# Altium project WIoT-QC01.PrjPcb
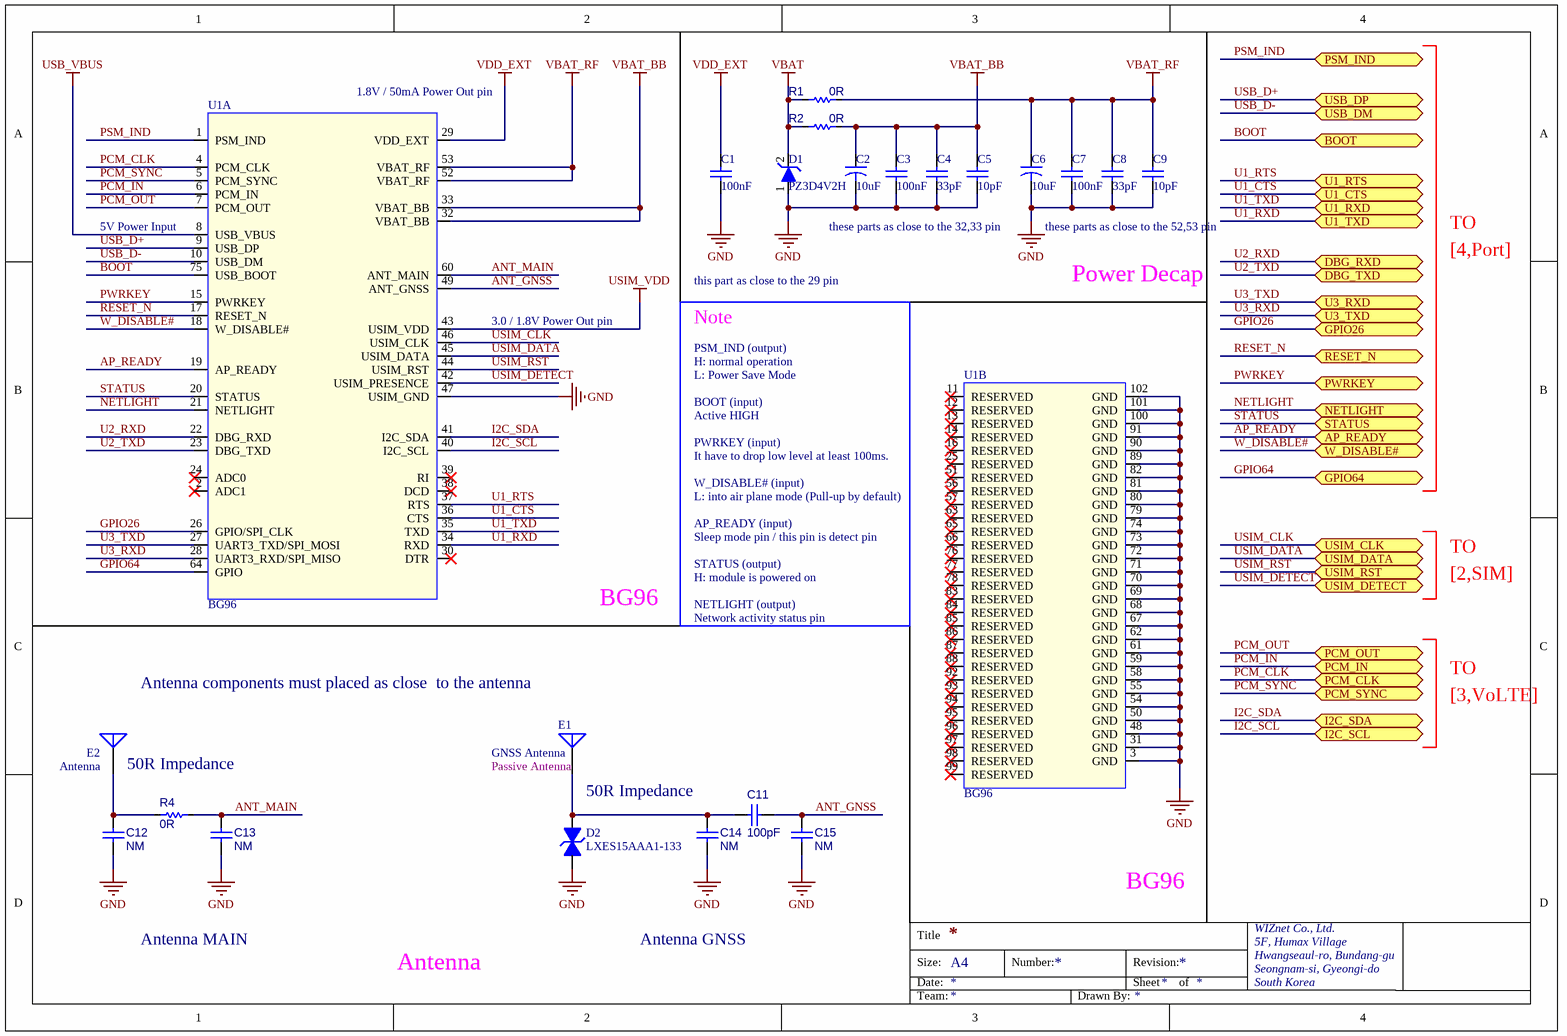
[diagram p0: 1.Quectel_BG96.SchDoc]
4 sheets, 94 parts. Net scope: flat (ports and power ports of the same name join across sheets).
Board file: WIoT-QC01 V1.0.PcbDoc
Sheets:
  1.Quectel_BG96.SchDoc
  2.SIM Interface.SchDoc
  3.VoLTE.SchDoc
  4.Port Interface.SchDoc

## Sheet 1.Quectel_BG96.SchDoc
size A4

### Parts
C1  100nF  [CAP-0402]
C2  10uF  [CAP-1206]
C3  100nF  [CAP-0402]
C4  33pF  [CAP-0402]
C5  10pF  [CAP-0402]
C6  10uF  [CAP-1206]
C7  100nF  [CAP-0402]
C8  33pF  [CAP-0402]
C9  10pF  [CAP-0402]
C11  100pF  [CAP-0402]
C12  NM  [CAP-0402]
C13  NM  [CAP-0402]
C14  NM  [CAP-0402]
C15  NM  [CAP-0402]
D1  PZ3D4V2H  [SOD-323]
D2  LXES15AAA1-133  [D0402]
E1  GNSS Antenna  [BNC-CMJ-S01-501]
E2  Antenna  [BNC-CMJ-S01-501]
R1  0R  [RES-0402]
R2  0R  [RES-0402]
R4  0R  [RES-0402]
U1  BG96  [BG-96]  (parts A,B of 2)

### Ports
AP_READY, BOOT, DBG_RXD, DBG_TXD, GPIO26, GPIO64, I2C_SCL, I2C_SDA, NETLIGHT, PCM_CLK, PCM_IN, PCM_OUT, PCM_SYNC, PSM_IND, PWRKEY, RESET_N, STATUS, U1_CTS, U1_RTS, U1_RXD, U1_TXD, U3_RXD, U3_TXD, USB_DM, USB_DP, USIM_CLK, USIM_DATA, USIM_DETECT, USIM_RST, W_DISABLE#

### Nets
GND: C1.2 C2.2 C3.2 C4.2 C5.2 C6.2 C7.2 C8.2 C9.2 C12.2 C13.2 C14.1 C15.1 D1.1(A) D2.2 U1.3(GND) U1.31(GND) U1.47(USIM_GND) U1.48(GND) U1.50(GND) U1.54(GND) U1.55(GND) U1.58(GND) U1.59(GND) U1.61(GND) U1.62(GND) U1.67(GND) U1.68(GND) U1.69(GND) U1.70(GND) U1.71(GND) U1.72(GND) U1.73(GND) U1.74(GND) U1.79(GND) U1.80(GND) U1.81(GND) U1.82(GND) U1.89(GND) U1.90(GND) U1.91(GND) U1.100(GND) U1.101(GND) U1.102(GND)
USB_VBUS: U1.8(USB_VBUS)
USIM_VDD: U1.43(USIM_VDD)
VBAT: D1.2(K) R1.1 R2.1
VBAT_BB: C2.1 C3.1 C4.1 C5.1 R2.2 U1.32(VBAT_BB) U1.33(VBAT_BB)
VBAT_RF: C6.1 C7.1 C8.1 C9.1 R1.2 U1.52(VBAT_RF) U1.53(VBAT_RF)
VDD_EXT: C1.1 U1.29(VDD_EXT)
ANT_GNSS: C11.1 C15.2 U1.49(ANT_GNSS)
ANT_MAIN: C13.1 R4.2 U1.60(ANT_MAIN)
AP_READY: U1.19(AP_READY) ; port AP_READY
BOOT: U1.75(USB_BOOT) ; port BOOT
GPIO26: U1.26(GPIO/SPI_CLK) ; port GPIO26
GPIO64: U1.64(GPIO) ; port GPIO64
I2C_SCL: U1.40(I2C_SCL) ; port I2C_SCL
I2C_SDA: U1.41(I2C_SDA) ; port I2C_SDA
NETLIGHT: U1.21(NETLIGHT) ; port NETLIGHT
PCM_CLK: U1.4(PCM_CLK) ; port PCM_CLK  [project net CODEC_PCM_CLK]
PCM_IN: U1.6(PCM_IN) ; port PCM_IN  [project net CODEC_PCM_IN]
PCM_OUT: U1.7(PCM_OUT) ; port PCM_OUT  [project net CODEC_PCM_OUT]
PCM_SYNC: U1.5(PCM_SYNC) ; port PCM_SYNC  [project net CODEC_PCM_SYNC]
PSM_IND: U1.1(PSM_IND) ; port PSM_IND
PWRKEY: U1.15(PWRKEY) ; port PWRKEY
RESET_N: U1.17(RESET_N) ; port RESET_N
STATUS: U1.20(STATUS) ; port STATUS
U1_CTS: U1.36(CTS) ; port U1_CTS
U1_RTS: U1.37(RTS) ; port U1_RTS
U1_RXD: U1.34(RXD) ; port U1_TXD
U1_TXD: U1.35(TXD) ; port U1_RXD
U2_RXD: U1.22(DBG_RXD) ; port DBG_RXD
U2_TXD: U1.23(DBG_TXD) ; port DBG_TXD
U3_RXD: U1.28(UART3_RXD/SPI_MISO) ; port U3_TXD
U3_TXD: U1.27(UART3_TXD/SPI_MOSI) ; port U3_RXD
USB_D+: U1.9(USB_DP) ; port USB_DP
USB_D-: U1.10(USB_DM) ; port USB_DM
USIM_CLK: U1.46(USIM_CLK) ; port USIM_CLK
USIM_DATA: U1.45(USIM_DATA) ; port USIM_DATA
USIM_DETECT: U1.42(USIM_PRESENCE) ; port USIM_DETECT
USIM_RST: U1.44(USIM_RST) ; port USIM_RST
W_DISABLE#: U1.18(W_DISABLE#) ; port W_DISABLE#
NetC11_2: C11.2 C14.2 D2.1 E1.1(A)
NetC12_1: C12.1 E2.1(A) R4.1

Not connected (* = marked no-connect by the designer): U1 2(ADC1)* 11(RESERVED)* 12(RESERVED)* 13(RESERVED)* 14(RESERVED)* 16(RESERVED)* 24(ADC0)* 25(RESERVED)* 30(DTR)* 38(DCD)* 39(RI)* 51(RESERVED)* 56(RESERVED)* 57(RESERVED)* 63(RESERVED)* 65(RESERVED)* 66(RESERVED)* 76(RESERVED)* 77(RESERVED)* 78(RESERVED)* 83(RESERVED)* 84(RESERVED)* 85(RESERVED)* 86(RESERVED)* 87(RESERVED)* 88(RESERVED)* 92(RESERVED)* 93(RESERVED)* 94(RESERVED)* 95(RESERVED)* 96(RESERVED)* 97(RESERVED)* 98(RESERVED)* 99(RESERVED)*

### Notes on the sheet
- (near U1) 1.8V / 50mA Power Out pin
- (near U1) 5V Power Input
- these parts as close to the 32,33 pin
- these parts as close to the 52,53 pin
- TO
- this part as close to the 29 pin
- Power Decap
- [4,Port]
- 3.0 / 1.8V Power Out pin
- PSM_IND (output)
- H: normal operation
- L: Power Save Mode
- Note
- BOOT (input)
- Active HIGH
- PWRKEY (input)
- (near U1) It have to drop low level at least 100ms.
- W_DISABLE# (input)
- (near U1) L: into air plane mode (Pull-up by default)
- AP_READY (input)
- (near U1) Sleep mode pin / this pin is detect pin
- STATUS (output)
- H: module is powered on
- [2,SIM]
- BG96
- NETLIGHT (output)
- Network activity status pin
- Antenna components must placed as close  to the antenna
- [3,VoLTE]
- (near E2) 50R Impedance
- (near E1) Passive Antenna
- 50R Impedance
- Antenna MAIN
- Antenna
- Antenna GNSS
- Title
- Size:
- Date:
- A4
- Number:
- Revision:
- Sheet
- of
- WIZnet Co., Ltd.
- 5F, Humax Village
- Hwangseaul-ro, Bundang-gu
- Seongnam-si, Gyeongi-do
- South Korea
- Team:
- Drawn By:

### Library data of the parts
C1 C3-C5 C7-C9 = CAP-0805: Ceramic CAP 0402
C2 C6 = CAP: Electrolytic Capacitors
C11-C15 = CAP-0402: Ceramic CAP 0402(1005)
D1 = DIODE-PZ3D4V2H: Zener 5.1V
D2 = DIODE-LXES15AAA1: Bi-directional TVS diode
E1 E2 = Antenna: Generic Antenna; Published: 24-Mar-1999; LatestRevisionDate: 17-Jul-2002; LatestRevisionNote: Re-released for DXP Platform.; PackageReference: PIN1; Publisher: Altium Limited
R1 R2 R4 = RES-0402
U1 = BG96_Quectel: Quectel, BG96, LTE CAT M1 module,

## Sheet 2.SIM Interface.SchDoc
size A4
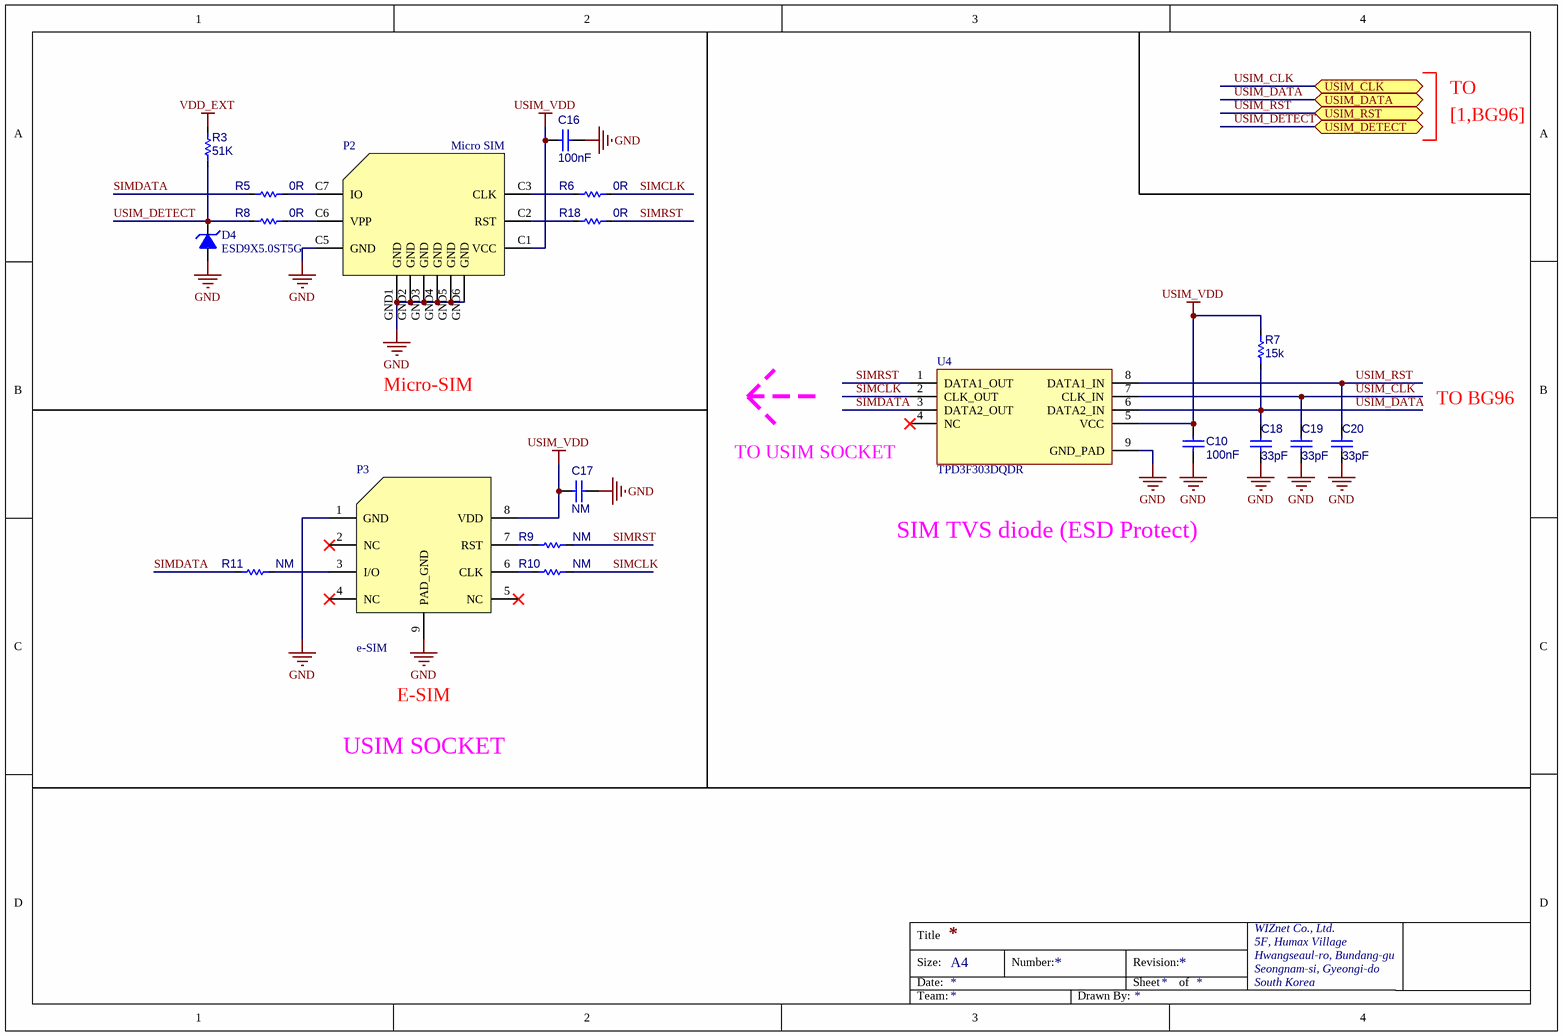
[diagram p1: 2.SIM Interface.SchDoc]

### Parts
C10  100nF  [CAP-0402]
C16  100nF  [CAP-0402]
C17  NM  [CAP-0402]
C18  33pF  [CAP-0402]
C19  33pF  [CAP-0402]
C20  33pF  [CAP-0402]
D4  ESD9X5.0ST5G  [SOD-923(1-C,2-A)]
P2  Micro SIM  [MOLEX-SD-78646-001]
P3  e-SIM  [MFF2(1.27/5x6)]
R3  51K  [RES-0402]
R5  0R  [RES-0402]
R6  0R  [RES-0402]
R7  15k  [RES-0402]
R8  0R  [RES-0402]
R9  NM  [RES-0402]
R10  NM  [RES-0402]
R11  NM  [RES-0402]
R18  0R  [RES-0402]
U4  TPD3F303DQDR  [PWSON08(0.4/1.45X1.8)]

### Ports
USIM_CLK, USIM_DATA, USIM_DETECT, USIM_RST

### Nets
GND: C10.2 C16.1 C17.1 C18.1 C19.1 C20.1 D4.2 P2.C5(GND) P2.GND1(GND) P2.GND2(GND) P2.GND3(GND) P2.GND4(GND) P2.GND5(GND) P2.GND6(GND) P3.1(GND) P3.9(PAD_GND) U4.9(GND_PAD)
USIM_VDD: C10.1 C16.2 C17.2 P2.C1(VCC) P3.8(VDD) R7.1 U4.5(VCC)
VDD_EXT: R3.1
SIMCLK: R6.1 R10.1 U4.2(CLK_OUT)
SIMDATA: R5.2 R11.2 U4.3(DATA2_OUT)
SIMRST: R9.1 R18.1 U4.1(DATA1_OUT)
USIM_CLK: C19.2 U4.7(CLK_IN) ; port USIM_CLK
USIM_DATA: C18.2 R7.2 U4.6(DATA2_IN) ; port USIM_DATA
USIM_DETECT: D4.1 R3.2 R8.2 ; port USIM_DETECT
USIM_RST: C20.2 U4.8(DATA1_IN) ; port USIM_RST
NetP2_C2: P2.C2(RST) R18.2
NetP2_C3: P2.C3(CLK) R6.2
NetP2_C6: P2.C6(VPP) R8.1
NetP2_C7: P2.C7(IO) R5.1
NetP3_3: P3.3(I/O) R11.1
NetP3_6: P3.6(CLK) R10.2
NetP3_7: P3.7(RST) R9.2

Not connected (* = marked no-connect by the designer): P3 2(NC)* 4(NC)* 5(NC)*; U4 4(NC)*

### Notes on the sheet
- TO
- [1,BG96]
- Micro-SIM
- TO BG96
- TO USIM SOCKET
- SIM TVS diode (ESD Protect)
- E-SIM
- USIM SOCKET
- Title
- Size:
- Date:
- A4
- Number:
- Revision:
- Sheet
- of
- WIZnet Co., Ltd.
- 5F, Humax Village
- Hwangseaul-ro, Bundang-gu
- Seongnam-si, Gyeongi-do
- South Korea
- Team:
- Drawn By:

### Library data of the parts
C10 C16-C20 = CAP-0402: Ceramic CAP 0402(1005)
D4 = ESD9X5.0ST5G: Uni-directional TVS diode
P2 = Micro SIM: Micro SIM SMT 1.45mm Push/Pull
R3 R5-R11 R18 = RES-0402
U4 = TPD3F303DQDR: ESD Protection SIM

## Sheet 3.VoLTE.SchDoc
size A4
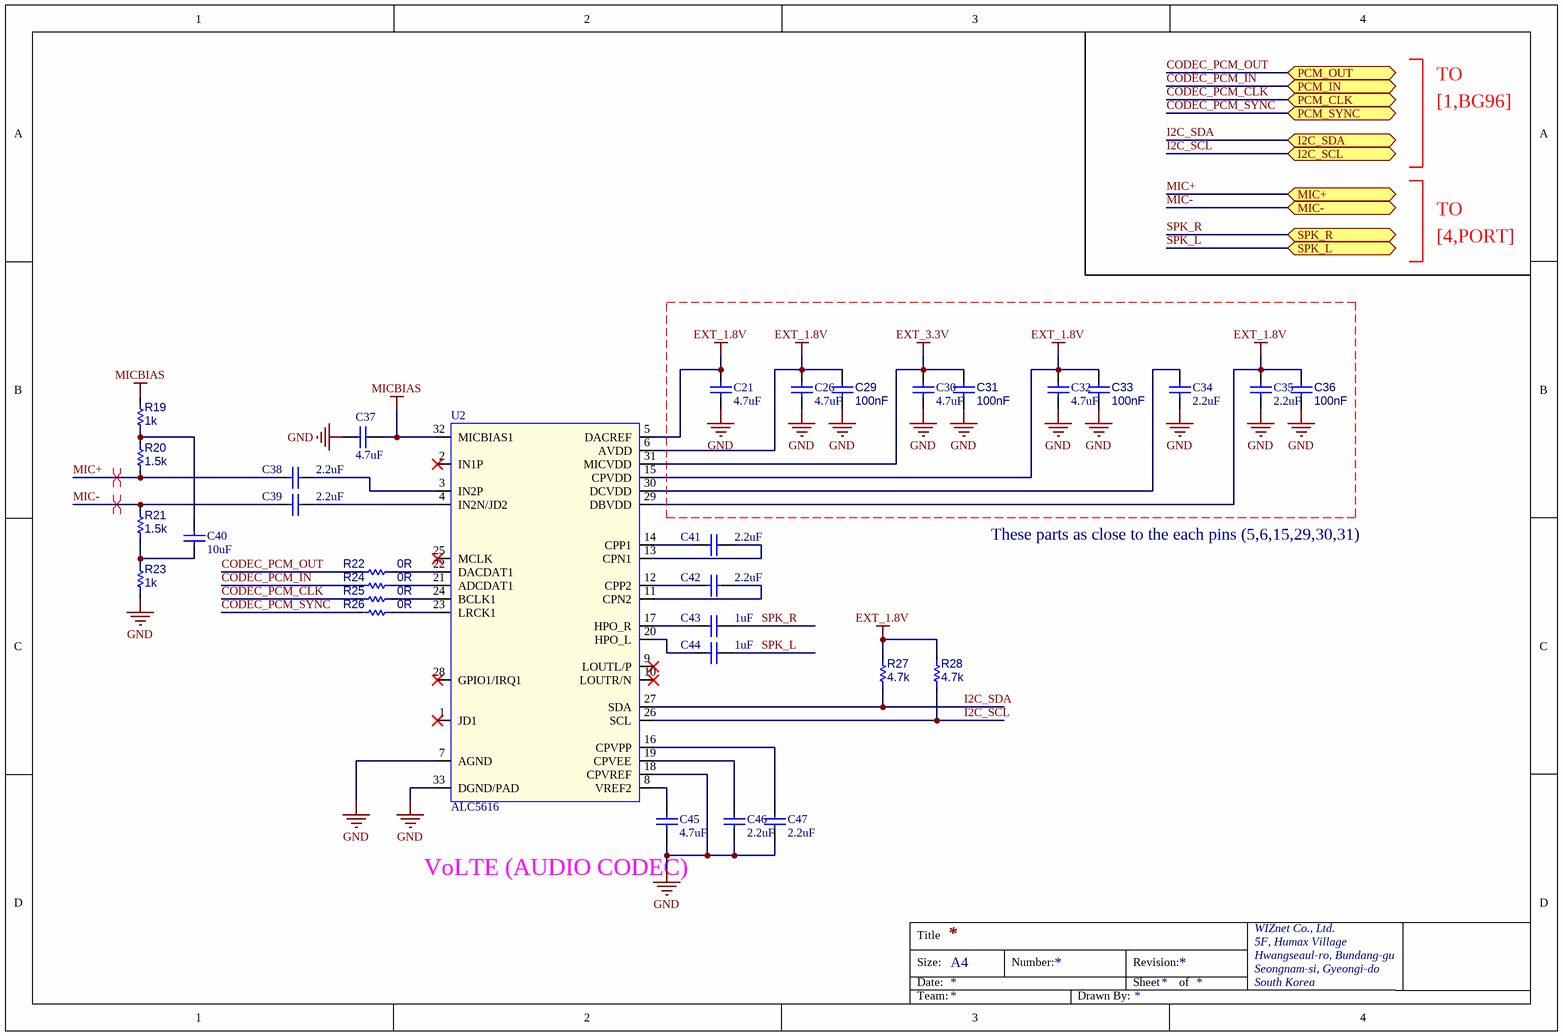
[diagram p2: 3.VoLTE.SchDoc]

### Parts
C21  4.7uF  [CAP-0603]
C26  4.7uF  [CAP-0603]
C29  100nF  [CAP-0402]
C30  4.7uF  [CAP-0603]
C31  100nF  [CAP-0402]
C32  4.7uF  [CAP-0603]
C33  100nF  [CAP-0402]
C34  2.2uF  [CAP-0603]
C35  2.2uF  [CAP-0603]
C36  100nF  [CAP-0402]
C37  4.7uF  [CAP-0603]
C38  2.2uF  [CAP-0603]
C39  2.2uF  [CAP-0603]
C40  10uF  [CAP-0603]
C41  2.2uF  [CAP-0603]
C42  2.2uF  [CAP-0603]
C43  1uF  [CAP-0603]
C44  1uF  [CAP-0603]
C45  4.7uF  [CAP-0603]
C46  2.2uF  [CAP-0603]
C47  2.2uF  [CAP-0603]
R19  1k  [RES-0402]
R20  1.5k  [RES-0402]
R21  1.5k  [RES-0402]
R22  0R  [RES-0402]
R23  1k  [RES-0402]
R24  0R  [RES-0402]
R25  0R  [RES-0402]
R26  0R  [RES-0402]
R27  4.7k  [RES-0402]
R28  4.7k  [RES-0402]
U2  ALC5616  [QFN32(0.4/4X4)]

### Ports
I2C_SCL, I2C_SDA, MIC+, MIC-, PCM_CLK, PCM_IN, PCM_OUT, PCM_SYNC, SPK_L, SPK_R

### Nets
EXT_1.8V: C21.2 C26.2 C29.2 C32.2 C33.2 C35.2 C36.2 R27.2 R28.2 U2.5(DACREF) U2.6(AVDD) U2.15(CPVDD) U2.29(DBVDD)
EXT_3.3V: C30.2 C31.2 U2.31(MICVDD)
GND: C21.1 C26.1 C29.1 C30.1 C31.1 C32.1 C33.1 C34.1 C35.1 C36.1 C37.1 C45.1 C46.1 C47.1 R23.1 U2.7(AGND) U2.18(CPVREF) U2.33(DGND/PAD)
MICBIAS: C37.2 R19.2 U2.32(MICBIAS1)
CODEC_PCM_CLK: R25.1 ; port PCM_CLK
CODEC_PCM_IN: R24.1 ; port PCM_IN
CODEC_PCM_OUT: R22.1 ; port PCM_OUT
CODEC_PCM_SYNC: R26.1 ; port PCM_SYNC
I2C_SCL: R28.1 U2.26(SCL) ; port I2C_SCL
I2C_SDA: R27.1 U2.27(SDA) ; port I2C_SDA
MIC+: C38.1 R20.1 ; port MIC+
MIC-: C39.1 R21.2 ; port MIC-
SPK_L: C44.2 ; port SPK_L
SPK_R: C43.2 ; port SPK_R
NetC34_2: C34.2 U2.30(DCVDD)
NetC38_2: C38.2 U2.3(IN2P)
NetC39_2: C39.2 U2.4(IN2N/JD2)
NetC40_1: C40.1 R21.1 R23.2
NetC40_2: C40.2 R19.1 R20.2
NetC41_1: C41.1 U2.14(CPP1)
NetC41_2: C41.2 U2.13(CPN1)
NetC42_1: C42.1 U2.12(CPP2)
NetC42_2: C42.2 U2.11(CPN2)
NetC43_1: C43.1 U2.17(HPO_R)
NetC44_1: C44.1 U2.20(HPO_L)
NetC45_2: C45.2 U2.8(VREF2)
NetC46_2: C46.2 U2.19(CPVEE)
NetC47_2: C47.2 U2.16(CPVPP)
NetR22_2: R22.2 U2.22(DACDAT1)
NetR24_2: R24.2 U2.21(ADCDAT1)
NetR25_2: R25.2 U2.24(BCLK1)
NetR26_2: R26.2 U2.23(LRCK1)

Not connected (* = marked no-connect by the designer): U2 1(JD1)* 2(IN1P)* 9(LOUTL/P)* 10(LOUTR/N)* 25(MCLK)* 28(GPIO1/IRQ1)*

### Layout directives
differential pair: MIC+, MIC-

### Notes on the sheet
- [1,BG96]
- TO
- [4,PORT]
- These parts as close to the each pins (5,6,15,29,30,31)
- (near C45) VoLTE (AUDIO CODEC)
- Title
- Size:
- Date:
- A4
- Number:
- Revision:
- Sheet
- of
- WIZnet Co., Ltd.
- 5F, Humax Village
- Hwangseaul-ro, Bundang-gu
- Seongnam-si, Gyeongi-do
- South Korea
- Team:
- Drawn By:

### Library data of the parts
C21 C26 C30 C32 C34 C35 C37-C47 = CAP-0603: Ceramic CAP 0603(1608)
C29 C31 C33 C36 = CAP-0402: Ceramic CAP 0402(1005)
R19-R28 = RES-0402
U2 = ALC5616: AUDIO CODEC with QUECTEL VOLTE

## Sheet 4.Port Interface.SchDoc
size A4
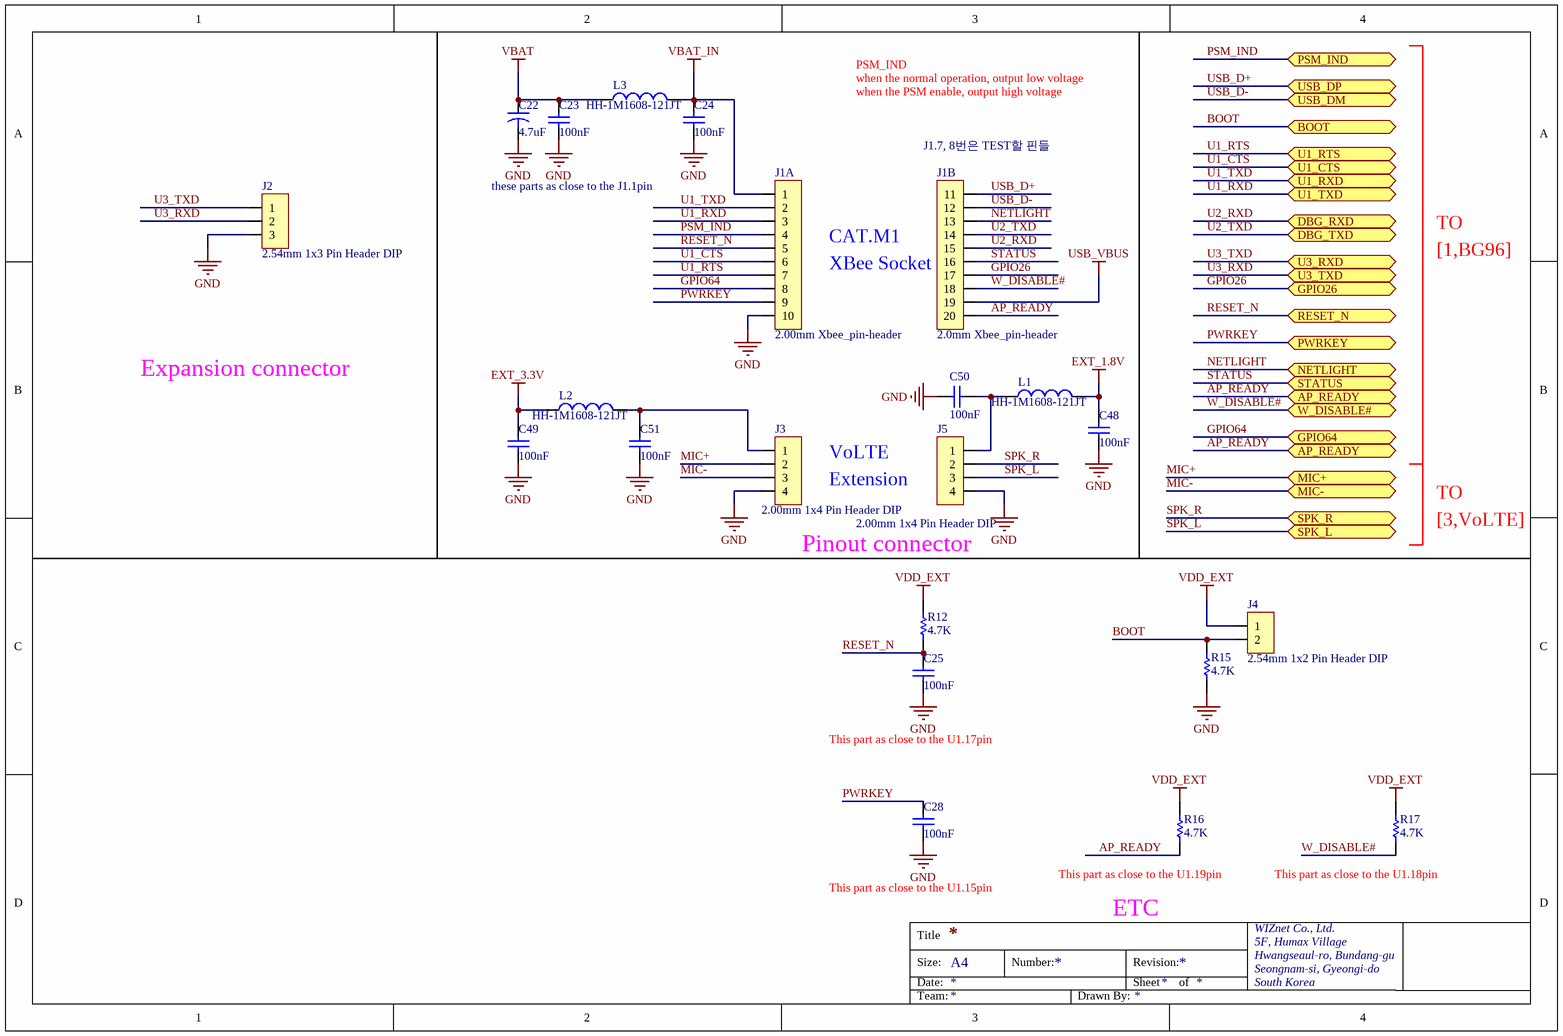
[diagram p3: 4.Port Interface.SchDoc]

### Parts
C22  4.7uF  [CAP-1206]
C23  100nF  [CAP-0402]
C24  100nF  [CAP-0402]
C25  100nF  [CAP-0402]
C28  100nF  [CAP-0402]
C48  100nF  [CAP-0402]
C49  100nF  [CAP-0402]
C50  100nF  [CAP-0402]
C51  100nF  [CAP-0402]
J1  2.00mm Xbee_pin-header  [Quectel CAT M1]  (parts A,B of 2)
J2  2.54mm 1x3 Pin Header DIP  [IDC-1X3]
J3  2.00mm 1x4 Pin Header DIP  [IDC(SMD)-1X4(2MM)]
J4  2.54mm 1x2 Pin Header DIP  [IDC-1X2]
J5  2.00mm 1x4 Pin Header DIP  [IDC(SMD)-1X4(2MM)]
L1  HH-1M1608-121JT  [IND-0603]
L2  HH-1M1608-121JT  [IND-0603]
L3  HH-1M1608-121JT  [IND-0603]
R12  4.7K  [RES-0402]
R15  4.7K  [RES-0402]
R16  4.7K  [RES-0402]
R17  4.7K  [RES-0402]

### Ports
AP_READY, BOOT, DBG_RXD, DBG_TXD, GPIO26, GPIO64, MIC+, MIC-, NETLIGHT, PSM_IND, PWRKEY, RESET_N, SPK_L, SPK_R, STATUS, U1_CTS, U1_RTS, U1_RXD, U1_TXD, U3_RXD, U3_TXD, USB_DM, USB_DP, W_DISABLE#

### Nets
EXT_1.8V: C48.1 L1.2
EXT_3.3V: C49.1 L2.1
GND: C22.2 C23.2 C24.2 C25.2 C28.2 C48.2 C49.2 C50.1 C51.2 J1.10 J2.3 J3.4 J5.4 R15.2
USB_VBUS: J1.19
VBAT: C22.1 C23.1 L3.1
VBAT_IN: C24.1 J1.1 L3.2
VDD_EXT: J4.1 R12.1 R16.1 R17.1
AP_READY: J1.20 R16.2 ; port AP_READY
BOOT: J4.2 R15.1 ; port BOOT
GPIO26: J1.17 ; port GPIO26
GPIO64: J1.8 ; port GPIO64
MIC+: J3.2 ; port MIC+
MIC-: J3.3 ; port MIC-
NETLIGHT: J1.13 ; port NETLIGHT
PSM_IND: J1.4 ; port PSM_IND
PWRKEY: C28.1 J1.9 ; port PWRKEY
RESET_N: C25.1 J1.5 R12.2 ; port RESET_N
SPK_L: J5.3 ; port SPK_L
SPK_R: J5.2 ; port SPK_R
STATUS: J1.16 ; port STATUS
U1_CTS: J1.6 ; port U1_CTS
U1_RTS: J1.7 ; port U1_RTS
U1_RXD: J1.3 ; port U1_TXD
U1_TXD: J1.2 ; port U1_RXD
U2_RXD: J1.15 ; port DBG_RXD
U2_TXD: J1.14 ; port DBG_TXD
U3_RXD: J2.2 ; port U3_TXD
U3_TXD: J2.1 ; port U3_RXD
USB_D+: J1.11 ; port USB_DP
USB_D-: J1.12 ; port USB_DM
W_DISABLE#: J1.18 R17.2 ; port W_DISABLE#
NetC50_2: C50.2 J5.1 L1.1
NetC51_1: C51.1 J3.1 L2.2

### Notes on the sheet
- PSM_IND
- when the normal operation, output low voltage
- when the PSM enable, output high voltage
- (near J1) J1.7, 8번은 TEST할 핀들
- these parts as close to the J1.1pin
- CAT.M1
- TO
- (near J1) XBee Socket
- [1,BG96]
- Expansion connector
- VoLTE
- Extension
- Pinout connector
- [3,VoLTE]
- This part as close to the U1.17pin
- This part as close to the U1.15pin
- (near R16) This part as close to the U1.19pin
- ETC
- (near R17) This part as close to the U1.18pin
- Title
- Size:
- Date:
- A4
- Number:
- Revision:
- Sheet
- of
- WIZnet Co., Ltd.
- 5F, Humax Village
- Hwangseaul-ro, Bundang-gu
- Seongnam-si, Gyeongi-do
- South Korea
- Team:
- Drawn By:

### Library data of the parts
C22 = CAP: Electrolytic Capacitors
C23-C25 C28 C48-C51 = CAP-0805: Ceramic CAP 0402
J1 = Xbee_pin-header: Xbee_pin-header, WizFi310, LoRa, LTE CAT M1
L1-L3 = IND-0603: Inductor 0603(1608)
R12 R15-R17 = RES-0402

## Nets that join several sheets
EXT_1.8V: 3.VoLTE (13 pins), 4.Port Interface (C48.1 L1.2)
EXT_3.3V: 3.VoLTE (C30.2 C31.2 U2.31), 4.Port Interface (C49.1 L2.1)
GND: 1.Quectel_BG96 (44 pins), 2.SIM Interface (17 pins), 3.VoLTE (18 pins), 4.Port Interface (14 pins)
USB_VBUS: 1.Quectel_BG96 (U1.8), 4.Port Interface (J1.19)
USIM_VDD: 1.Quectel_BG96 (U1.43), 2.SIM Interface (7 pins)
VBAT: 1.Quectel_BG96 (D1.2 R1.1 R2.1), 4.Port Interface (C22.1 C23.1 L3.1)
VDD_EXT: 1.Quectel_BG96 (C1.1 U1.29), 2.SIM Interface (R3.1), 4.Port Interface (J4.1 R12.1 R16.1 R17.1)
AP_READY: 1.Quectel_BG96 (U1.19), 4.Port Interface (J1.20 R16.2)
BOOT: 1.Quectel_BG96 (U1.75), 4.Port Interface (J4.2 R15.1)
CODEC_PCM_CLK: 1.Quectel_BG96 (U1.4), 3.VoLTE (R25.1)
CODEC_PCM_IN: 1.Quectel_BG96 (U1.6), 3.VoLTE (R24.1)
CODEC_PCM_OUT: 1.Quectel_BG96 (U1.7), 3.VoLTE (R22.1)
CODEC_PCM_SYNC: 1.Quectel_BG96 (U1.5), 3.VoLTE (R26.1)
GPIO26: 1.Quectel_BG96 (U1.26), 4.Port Interface (J1.17)
GPIO64: 1.Quectel_BG96 (U1.64), 4.Port Interface (J1.8)
I2C_SCL: 1.Quectel_BG96 (U1.40), 3.VoLTE (R28.1 U2.26)
I2C_SDA: 1.Quectel_BG96 (U1.41), 3.VoLTE (R27.1 U2.27)
MIC+: 3.VoLTE (C38.1 R20.1), 4.Port Interface (J3.2)
MIC-: 3.VoLTE (C39.1 R21.2), 4.Port Interface (J3.3)
NETLIGHT: 1.Quectel_BG96 (U1.21), 4.Port Interface (J1.13)
PSM_IND: 1.Quectel_BG96 (U1.1), 4.Port Interface (J1.4)
PWRKEY: 1.Quectel_BG96 (U1.15), 4.Port Interface (C28.1 J1.9)
RESET_N: 1.Quectel_BG96 (U1.17), 4.Port Interface (C25.1 J1.5 R12.2)
SPK_L: 3.VoLTE (C44.2), 4.Port Interface (J5.3)
SPK_R: 3.VoLTE (C43.2), 4.Port Interface (J5.2)
STATUS: 1.Quectel_BG96 (U1.20), 4.Port Interface (J1.16)
U1_CTS: 1.Quectel_BG96 (U1.36), 4.Port Interface (J1.6)
U1_RTS: 1.Quectel_BG96 (U1.37), 4.Port Interface (J1.7)
U1_RXD: 1.Quectel_BG96 (U1.34), 4.Port Interface (J1.3)
U1_TXD: 1.Quectel_BG96 (U1.35), 4.Port Interface (J1.2)
U2_RXD: 1.Quectel_BG96 (U1.22), 4.Port Interface (J1.15)
U2_TXD: 1.Quectel_BG96 (U1.23), 4.Port Interface (J1.14)
U3_RXD: 1.Quectel_BG96 (U1.28), 4.Port Interface (J2.2)
U3_TXD: 1.Quectel_BG96 (U1.27), 4.Port Interface (J2.1)
USB_D+: 1.Quectel_BG96 (U1.9), 4.Port Interface (J1.11)
USB_D-: 1.Quectel_BG96 (U1.10), 4.Port Interface (J1.12)
USIM_CLK: 1.Quectel_BG96 (U1.46), 2.SIM Interface (C19.2 U4.7)
USIM_DATA: 1.Quectel_BG96 (U1.45), 2.SIM Interface (C18.2 R7.2 U4.6)
USIM_DETECT: 1.Quectel_BG96 (U1.42), 2.SIM Interface (D4.1 R3.2 R8.2)
USIM_RST: 1.Quectel_BG96 (U1.44), 2.SIM Interface (C20.2 U4.8)
W_DISABLE#: 1.Quectel_BG96 (U1.18), 4.Port Interface (J1.18 R17.2)